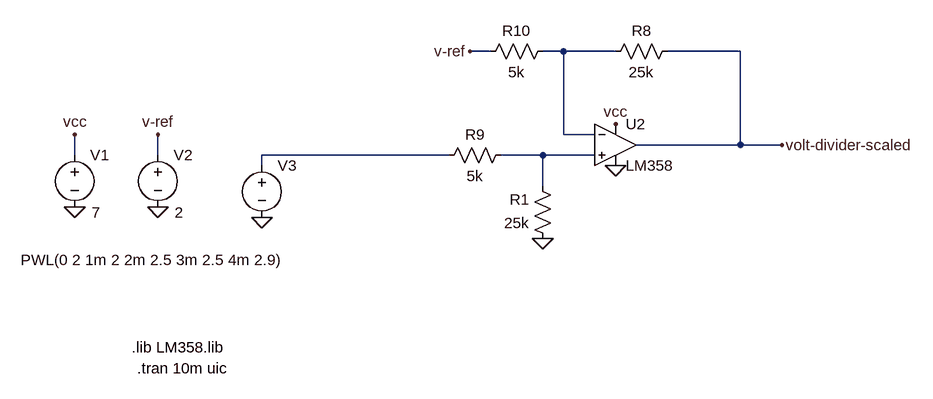
[diagram p0: schematic temp-measurement-scale.asc]
temp-measurement-scale.asc, the LTspice schematic file:
Version 4
SHEET 1 1500 1016
WIRE 256 512 224 512
WIRE 368 512 336 512
WIRE 448 512 368 512
WIRE 640 512 528 512
WIRE 368 640 368 512
WIRE 416 640 368 640
WIRE 640 656 640 512
WIRE 640 656 480 656
WIRE 704 656 640 656
WIRE -384 672 -384 640
WIRE -256 672 -256 640
WIRE 192 672 -96 672
WIRE 336 672 272 672
WIRE 416 672 336 672
WIRE -96 688 -96 672
WIRE 336 720 336 672
FLAG 448 688 0
FLAG -384 752 0
FLAG -384 640 vcc
FLAG 448 624 vcc
FLAG 704 656 volt-divider-scaled
FLAG -96 768 0
FLAG -256 752 0
FLAG -256 640 v-ref
FLAG 224 512 v-ref
FLAG 336 800 0
SYMBOL OpAmps\\opamp2 448 592 R0
SYMATTR InstName U2
SYMATTR Value LM358
SYMBOL voltage -384 656 R0
WINDOW 3 26 104 Left 2
WINDOW 123 0 0 Left 0
WINDOW 39 0 0 Left 0
SYMATTR Value 7
SYMATTR InstName V1
SYMBOL res 544 496 R90
WINDOW 0 0 56 VBottom 2
WINDOW 3 32 56 VTop 2
SYMATTR InstName R8
SYMATTR Value 25k
SYMBOL res 288 656 R90
WINDOW 0 0 56 VBottom 2
WINDOW 3 32 56 VTop 2
SYMATTR InstName R9
SYMATTR Value 5k
SYMBOL res 352 496 R90
WINDOW 0 0 56 VBottom 2
WINDOW 3 32 56 VTop 2
SYMATTR InstName R10
SYMATTR Value 5k
SYMBOL voltage -96 672 R0
WINDOW 3 -371 161 Left 2
WINDOW 123 0 0 Left 0
WINDOW 39 24 44 Left 2
SYMATTR Value PWL(0 2 1m 2 2m 2.5 3m 2.5 4m 2.9)
SYMATTR InstName V3
SYMBOL voltage -256 656 R0
WINDOW 3 26 104 Left 2
WINDOW 123 0 0 Left 0
WINDOW 39 0 0 Left 0
SYMATTR Value 2
SYMATTR InstName V2
SYMBOL res 352 816 R180
WINDOW 0 36 76 Left 2
WINDOW 3 36 40 Left 2
SYMATTR InstName R1
SYMATTR Value 25k
TEXT -296 968 Left 2 !.lib LM358.lib
TEXT -288 1000 Left 2 !.tran 10m uic

The netlist it stands for:
* temp-measurement-scale.asc
XU2 N003 N001 vcc 0 volt-divider-scaled LM358  ; pins In+ In- V+ V- OUT
V1 vcc 0 7
R8 volt-divider-scaled N001 25k
R9 N003 N002 5k
R10 N001 v-ref 5k
V3 N002 0 PWL(0 2 1m 2 2m 2.5 3m 2.5 4m 2.9)
V2 v-ref 0 2
R1 0 N003 25k
.lib LM358.lib
.tran 10m uic
.backanno
.end

* Results of the author's LTspice run, read from the files saved beside the schematic
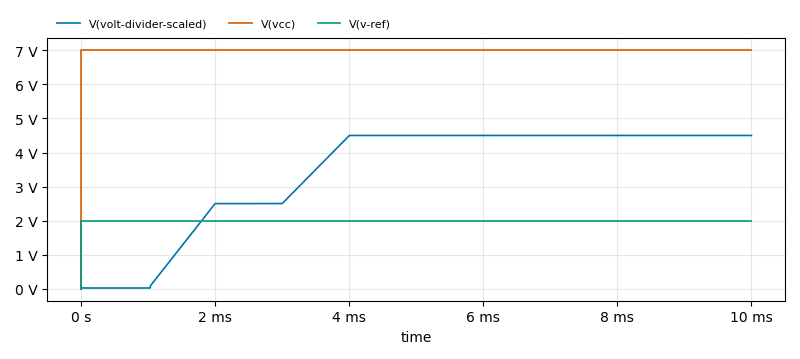
[diagram p1: Transient Analysis of temp-measurement-scale.asc, plotted from the saved traces]
* Transient Analysis, 1 run:
*   V(volt-divider-scaled): min -194.5 µV, max 4.502 V, average 3.428 V, rms 3.786 V, last 4.502 V
*   V(vcc): min 0 V, max 7 V, average 7 V, rms 7 V, last 7 V
*   V(v-ref): min 0 V, max 2 V, average 2 V, rms 2 V, last 2 V